# Altium schematic sheet Sch_Master_Screen.SchDoc
size A3; SheetNumber: 1; SheetTotal: 1
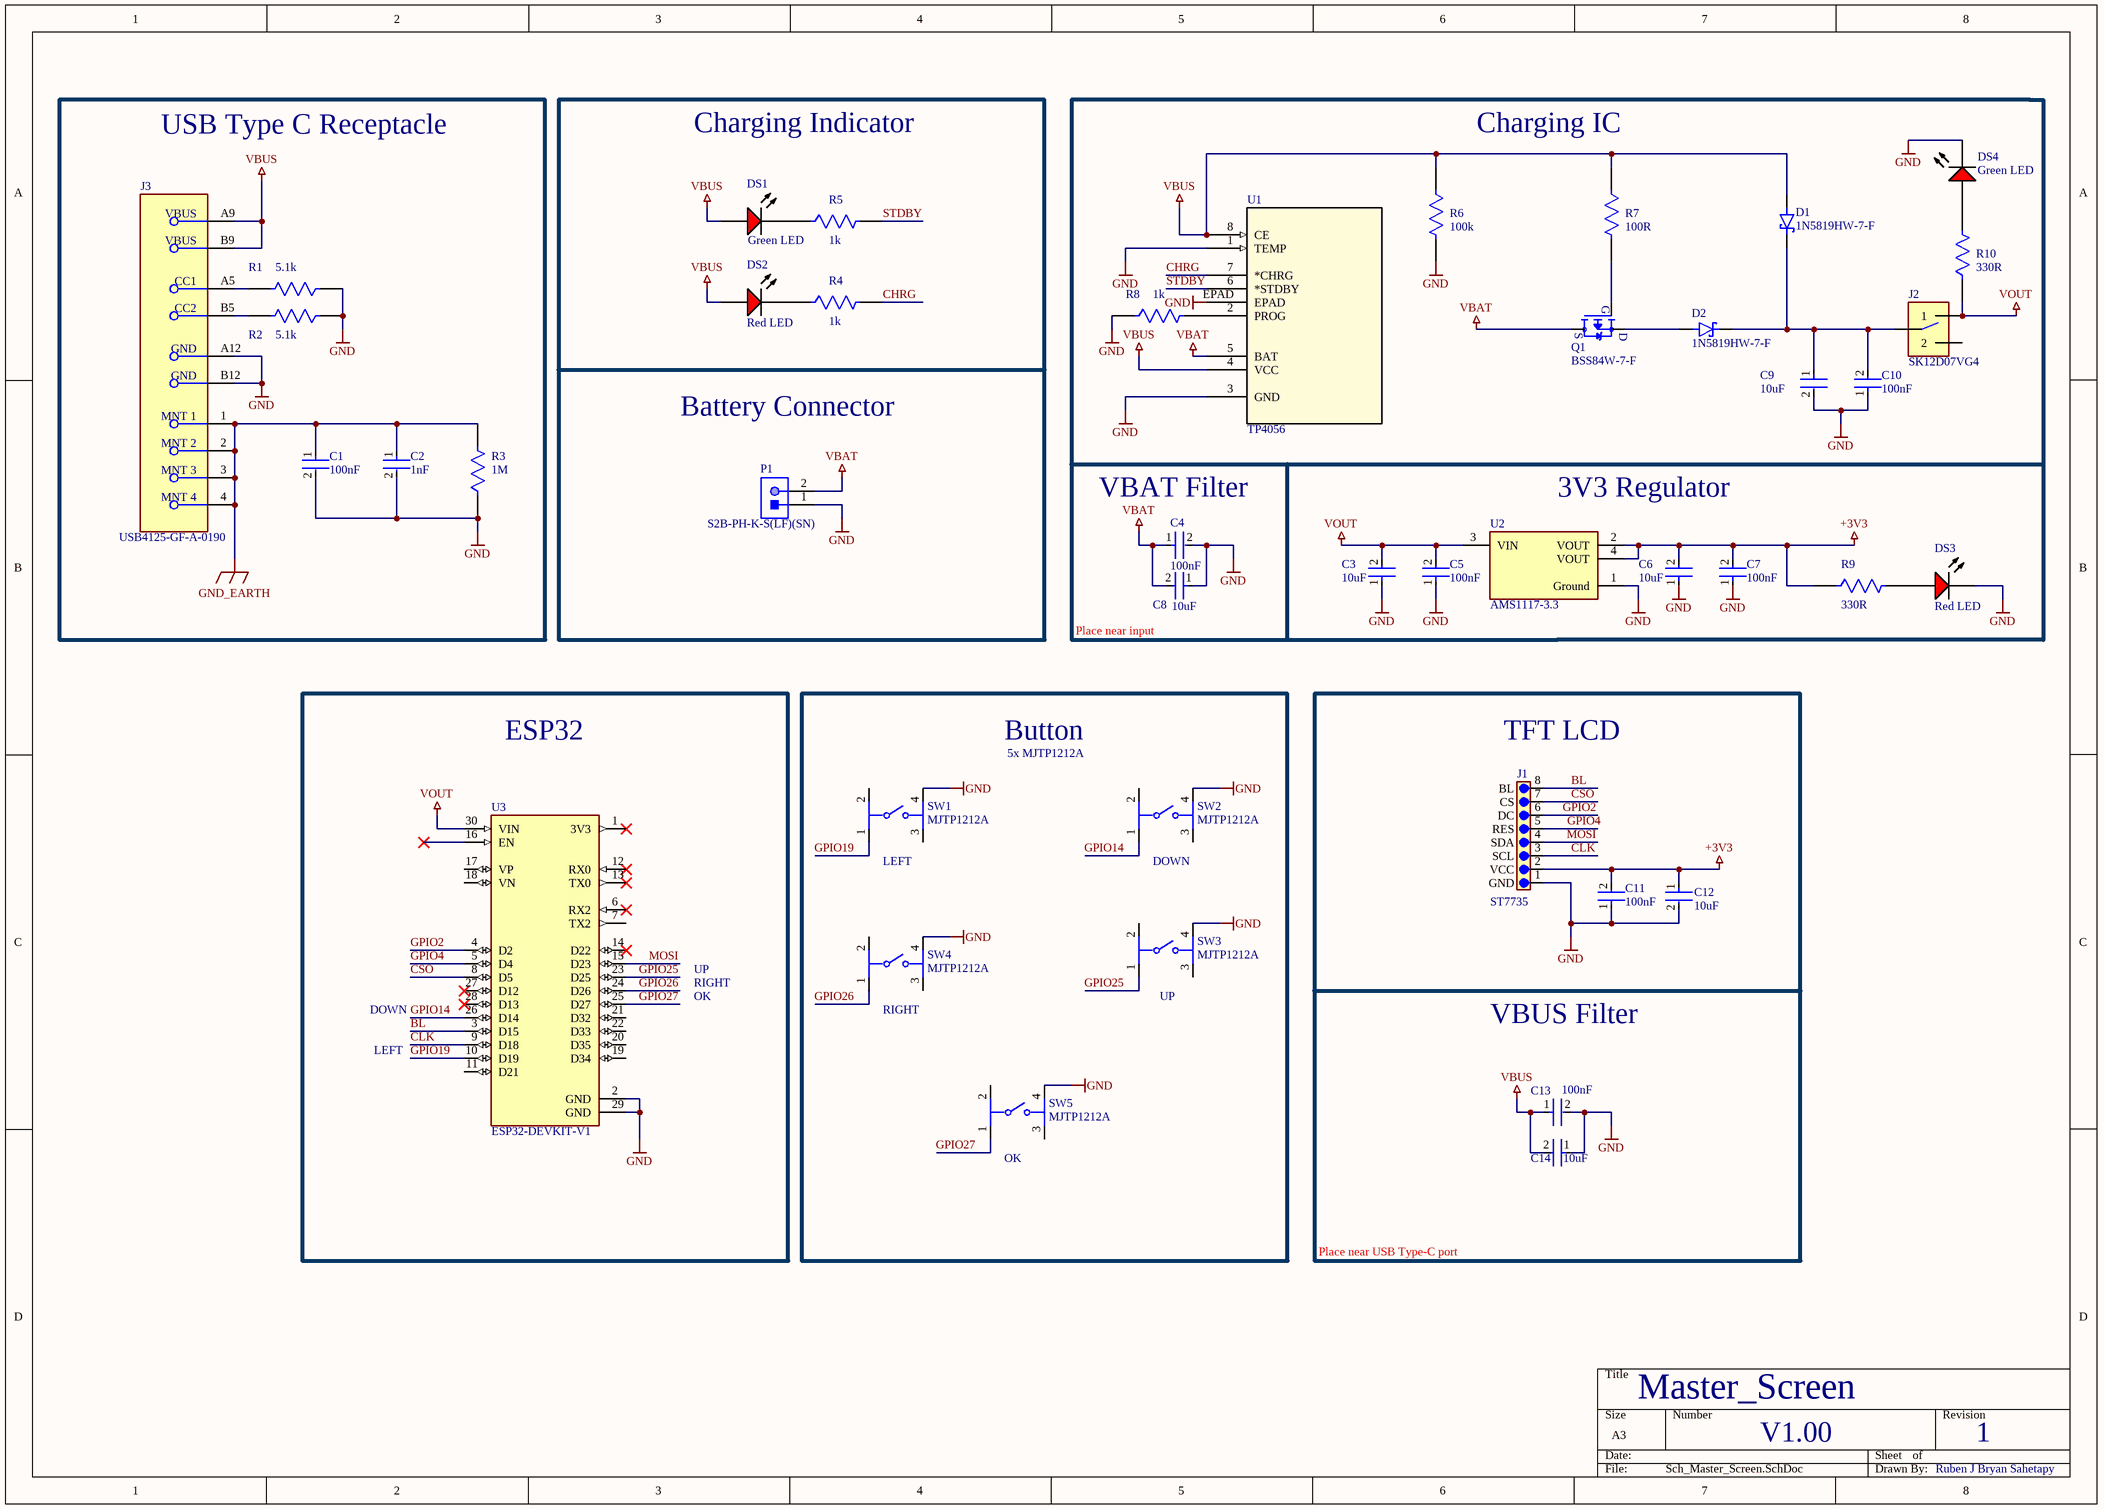
[diagram p0: Sch_Master_Screen.SchDoc]

## Parts
C1  100nF  [FP-CC0805-0_85-MFG]
C2  1nF  [FP-CC0805-0_85-MFG]
C3  10uF  [FP-CC0805-0_85-MFG]
C4  100nF  [FP-CC0805-0_85-MFG]
C5  100nF  [FP-CC0805-0_85-MFG]
C6  10uF  [FP-CC0805-0_85-MFG]
C7  100nF  [FP-CC0805-0_85-MFG]
C8  10uF  [FP-CC0805-0_85-MFG]
C9  10uF  [FP-CC0805-0_85-MFG]
C10  100nF  [FP-CC0805-0_85-MFG]
C11  100nF  [FP-CC0805-0_85-MFG]
C12  10uF  [FP-CC0805-0_85-MFG]
C13  100nF  [FP-CC0805-0_85-MFG]
C14  10uF  [FP-CC0805-0_85-MFG]
D1  1N5819HW-7-F  [SOD3715X145N]
D2  1N5819HW-7-F  [SOD3715X145N]
DS1  Green LED  [LUMX-SML-LX1206IC_V]
DS2  Red LED  [LUMX-SML-LX1206IC_V]
DS3  Red LED  [LUMX-SML-LX1206IC_V]
DS4  Green LED  [LUMX-SML-LX1206IC_V]
J1  ST7735  [ST7735]
J2  SK12D07VG4  [SK12D07VG4]
J3  USB4125-GF-A-0190  [FP-USB4125-GF-A-0190-MFG]
P1  S2B-PH-K-S(LF)(SN)  [JST-S2B-PH-K-S_V]
Q1  BSS84W-7-F  [SOT65P222X110-3N]
R1  5.1k  [FP-RC1206-MFG]
R2  5.1k  [FP-RC1206-MFG]
R3  1M  [FP-RC1206-MFG]
R4  1k  [FP-RC1206-MFG]
R5  1k  [FP-RC1206-MFG]
R6  100k  [FP-RC1206-MFG]
R7  100R  [FP-RC1206-MFG]
R8  1k  [FP-RC1206-MFG]
R9  330R  [FP-RC1206-MFG]
R10  330R  [FP-RC1206-MFG]
SW1  MJTP1212A  [FP-MJTP1212A-MFG]
SW2  MJTP1212A  [FP-MJTP1212A-MFG]
SW3  MJTP1212A  [FP-MJTP1212A-MFG]
SW4  MJTP1212A  [FP-MJTP1212A-MFG]
SW5  MJTP1212A  [FP-MJTP1212A-MFG]
U1  TP4056  [SOP8-PP_TPW]
U2  AMS1117-3.3  [FP-AMS1117-IPC_C]
U3  ESP32-DEVKIT-V1  [MODULE_ESP32_DEVKIT_V1]

## Blocks framed on the sheet
USB Type C Receptacle: C1 C2 J3 R1-R3
ESP32: U3
Button: SW1-SW5

## Nets
+3V3: C6.2 C7.2 C11.2 C12.1 J1.2(VCC) R9.1 U2.2(VOUT) U2.4(VOUT)
GND: C1.2 C2.2 C3.1 C4.2 C5.1 C6.1 C7.1 C8.1 C9.2 C10.1 C11.1 C12.2 C13.2 C14.1 DS3.2(K) DS4.2(K) J1.1(GND) J3.A12(GND) J3.B12(GND) P1.1 R1.1 R2.1 R3.1 R6.2 R8.1 SW1.4 SW2.4 SW3.4 SW4.4 SW5.4 U1.1(TEMP) U1.3(GND) U1.EPAD U2.1(Ground) U3.2(GND) U3.29(GND)
GND_EARTH: C1.1 C2.1 J3.1(MNT_1) J3.2(MNT_2) J3.3(MNT_3) J3.4(MNT_4) R3.2
VBAT: C4.1 C8.2 P1.2 Q1.3(D) U1.5(BAT)
VBUS: C13.1 C14.2 D1.A DS1.1(A) DS2.1(A) J3.A9(VBUS) J3.B9(VBUS) R6.1 R7.1 U1.4(VCC) U1.8(CE)
VOUT: C3.2 C5.2 J2.1 R10.1 U2.3(VIN) U3.30(VIN)
BL: J1.8(BL) U3.3(D15)
CHRG: R4.2 U1.7(*CHRG)
CLK: J1.3(SCL) U3.9(D18)
CSO: J1.7(CS) U3.8(D5)
GPIO2: J1.6(DC) U3.4(D2)
GPIO4: J1.5(RES) U3.5(D4)
GPIO14: SW2.1 U3.26(D14)
GPIO19: SW1.1 U3.10(D19)
GPIO25: SW3.1 U3.23(D25)
GPIO26: SW4.1 U3.24(D26)
GPIO27: SW5.1 U3.25(D27)
MOSI: J1.4(SDA) U3.15(D23)
STDBY: R5.2 U1.6(*STDBY)
NetC9_1: C9.1 C10.2 D1.C(K) D2.C(K) J2.COM
NetD2_A: D2.A Q1.2(S)
NetDS1_2: DS1.2(K) R5.1
NetDS2_2: DS2.2(K) R4.1
NetDS3_1: DS3.1(A) R9.2
NetDS4_1: DS4.1(A) R10.2
NetJ3_A5: J3.A5(CC1) R1.2
NetJ3_B5: J3.B5(CC2) R2.2
NetQ1_1: Q1.1(G) R7.2
NetR8_2: R8.2 U1.2(PROG)

Not connected (* = marked no-connect by the designer): J2 2; SW1 2 3; SW2 2 3; SW3 2 3; SW4 2 3; SW5 2 3; U3 1(3V3)* 6(RX2)* 7(TX2) 11(D21) 12(RX0)* 13(TX0)* 14(D22)* 16(EN)* 17(VP) 18(VN) 19(D34) 20(D35) 21(D32) 22(D33) 27(D12)* 28(D13)*

## Notes on the sheet
- Charging Indicator
- Charging IC
- Battery Connector
- (near C4) VBAT Filter
- 3V3 Regulator
- (near C8) Place near input
- 5x MJTP1212A
- (near J1) TFT LCD
- (near SW1) LEFT
- (near SW2) DOWN
- RIGHT
- UP
- DOWN
- LEFT
- OK
- (near SW4) RIGHT
- (near SW3) UP
- VBUS Filter
- (near SW5) OK
- Place near USB Type-C port
- Master_Screen
- V1.00
- 1
- Ruben J Bryan Sahetapy

## Library data of the parts
C1 C4 C5 C7 C10 C11 C13 = CMP-1036-04402-6: CAP CER 0.1UF 16V X7R 0805; Manufacturer Part Number: CC0805KRX7R7BB104; Manufacturer: Yageo; Material: Ceramic; Tolerance: 0.1; Temperature: -30°C to +85°C; Lead Free: Yes; Footprint Url: http://www.yageo.com/exep/pages/download/literatures/UPY-C_GEN_24.pdf; Voltage Rating: 16 V; Package: CC0805-0.85; RoHS: TRUE; Digikey Description: CAP CER 0.1UF 16V X7R 0805; Category: Cap; Octopart: https://octopart.com/cc0805krx7r7bb104-yageo-39467769; Capacitance: 100 nF; Device Class L3: Ceramic Capacitors; ComponentLink2URL: http://www.yageo.com/documents/recent/UPY-GPHC_Y5V_6.3V-to-50V_8.pdf; Value: 100 nF; Temperature Range Low: -30°C; Mouser Description: Multilayer Ceramic Capacitors MLCC - SMD/SMT 100nF 16V X7R 10%; Automotive: No; Device Class L2: Capacitors; Height: 0.95mm; ComponentLink2Description: Datasheet; Temperature Characteristic: X7R; Ipc Land Pattern Name: CAPC200125X85; Device Class L1: Passive Components; Temperature Range High: +85°C
C2 C3 C6 C8 C9 C12 C14 = CMP-1036-04402-6: CAP CER 0.1UF 16V X7R 0805; Manufacturer Part Number: CC0805KRX7R7BB104; Manufacturer: Yageo; Material: Ceramic; Tolerance: 0.1; Capacitance: 100 nF; Value: 100 nF; Temperature: -30°C to +85°C; Lead Free: Yes; Footprint Url: http://www.yageo.com/exep/pages/download/literatures/UPY-C_GEN_24.pdf; Voltage Rating: 16 V; Package: CC0805-0.85; RoHS: TRUE; Digikey Description: CAP CER 0.1UF 16V X7R 0805; Category: Cap; Octopart: https://octopart.com/cc0805krx7r7bb104-yageo-39467769; Device Class L3: Ceramic Capacitors; ComponentLink2URL: http://www.yageo.com/documents/recent/UPY-GPHC_Y5V_6.3V-to-50V_8.pdf; Temperature Range Low: -30°C; Mouser Description: Multilayer Ceramic Capacitors MLCC - SMD/SMT 100nF 16V X7R 10%; Automotive: No; Device Class L2: Capacitors; Height: 0.95mm; ComponentLink2Description: Datasheet; Temperature Characteristic: X7R; Ipc Land Pattern Name: CAPC200125X85; Device Class L1: Passive Components; Temperature Range High: +85°C
D1 D2 = 1N5819HW-7-F: Schottky Diodes & Rectifiers SOD-123; Value: Vf = 450 mV; MF: Diodes Inc.; SnapEDA_Link: https://www.snapeda.com/parts/1N5819HW-7-F/Diodes+Inc./view-part/?ref=snap; Purchase-URL: https://pricing.snapeda.com/search/part/1N5819HW-7-F/?ref=eda; Availability: In Stock; Price: None; Package: SOD-123 Fairchild Semiconductor; Check_prices: https://www.snapeda.com/parts/1N5819HW-7-F/Diodes+Inc./view-part/?ref=eda; MP: 1N5819HW-7-F; Part Number: 1N5819HW-7-F; PartID: 1N5819HW-7-F; TempMin: -65; TempMax: 125; Link: https://4donline.ihs.com/images/VipMasterIC/IC/DIOD/DIOD-S-A0011437026/DIOD-S-A0011683586-1.pdf?hkey=CECEF36DEECDED6468708AAF2E19C0C6
DS1-DS4 = CMP-2000-07123-1: LED Red, 65 mW, -40 to 85 degC, 2-Pin SMD, RoHS, Tape and Reel; Manufacturer: Lumex; Part No: SML-LX1206IC-TR; LED Material: GaAsP; Peak Wavelength: 635nm; Number of LEDs: 1; Viewing Angle: 160; Reverse Voltage: 5(Min)V; Lens Appearance: ColorlessNonDiffused; Intensity: 6mcd; Type: Uni-Color; Pin_Count: 2; Lens Dimensions: 2x1.6x0.5mm; Mounting: SurfaceMount; ECCN: EAR99; RoHS: Unknown; Package Description: 2-Pin Surface Mount Device, Body 3.2 x 1.5 mm; Mounting Technology: SurfaceMount; Dominant Wavelength: N/A; Supplier_Package: SMD; Supplier Standard Pack: 3,000; Color: Red; Dimension: 3.2x1.6x1.1mm; HTS: 8541402000; Family: SML-LX1206IC; Supplier: Lumex; Datasheet URL: http://www.lumex.com/content/files/ProductAttachment/SML-LX1206IC-TR.pdf; Package Reference: SML-LX1206IC; Manufacturer URL: http://www.lumexinstruments.com/; Operating Temperature: -25to85C; Packaging: TapeandReel; Datasheet Version: Rev. J, 08/2012
J1 = TFT-ST7735: 1.8 inches 128x160 RGB TFT LCD - ST7735 DRIVER; Value: 1.8 Inch 128x160; Part Number: TFT-ST7735; PartID: TFT-ST7735; TempMin: -30; TempMax: 80; Link: https://grabcad.com/library/1-8-inches-128x160-rgb-tft-lcd-st7735-driver-1
J2 = SK12D07VG4: Slide Switches - Side Knob; Value: 0.3A @ 30 VDC; MF: C&K; SnapEDA_Link: https://www.snapeda.com/parts/SK12D07VG4/C%2526K/view-part/?ref=snap; Package: None; MP: SK12D07VG4; Check_prices: https://www.snapeda.com/parts/SK12D07VG4/C%2526K/view-part/?ref=eda; Part Number: SK12D07VG4; PartID: SK12D07VG4; TempMin: -20; TempMax: 70; Link: https://www.snapeda.com/parts/SK12D07VG4/C&K/datasheet/
J3 = CMP-245163-000004-1: CONN RCPT TYPE C 6P SMD RA
P1 = CMP-1755-00004-1: Male Header, Pitch 2 mm, 1 x 2 Position, Height 4.8 mm, Tail Length 3.4 mm, -25 to 85 degC, RoHS, Bulk; Case\Package: Radial; Tolerance: 20%; Capacitance: 10 uF; Voltage Rating (DC): 50 V; Packaging: Bulk; ComponentLink1URL: http://www.jst-mfg.com/product/pdf/eng/ePH.pdf; Radiation Hardening: No; Height: 11 mm; Package Quantity: 200; PackageDescription: Male Header, Pitch 2 mm, 1 x 2 Position, Height 4.8 mm, Tail Length 3.4 mm; PackageReference: S2B-PH-K-S; Diameter: 5 mm; Pins: 2; Mount: Through Hole; Max Operating Temperature: 85 degC; Min Operating Temperature: -40 degC; ComponentLink1Description: Datasheet; DatasheetVersion: Dec-12; Length: 11 mm; Lead Pitch: 2 mm; REACH SVHC: No SVHC; Voltage Rating: 50 V; RoHSCompliant: true
Q1 = BSS84W-7-F: MOSFET P-Channel 50V 130MA SOT323; MF: Diodes Inc.; SnapEDA_Link: https://www.snapeda.com/parts/BSS84W-7-F/Diodes+Inc./view-part/?ref=snap; Availability: In Stock; Check_prices: https://www.snapeda.com/parts/BSS84W-7-F/Diodes+Inc./view-part/?ref=eda; MP: BSS84W-7-F; Price: None; Purchase-URL: https://pricing.snapeda.com/search/part/BSS84W-7-F/?ref=eda; Package: SOT-323 Diodes Inc.; Value: 0 V 130mA; Part Number: BSS84W-7-F; PartID: BSS84W-7-F; TempMin: -55; TempMax: 150; Link: https://www.diodes.com/assets/Datasheets/BSS84W.pdf
R1-R10 = CMP-2100-03681-2: RES SMD 0 OHM JUMPER 1/4W 1206; Manufacturer Part Number: RC1206JR-070RL; Manufacturer: YAGEO; Voltage Rating: 200V; Temperature Coefficient: 300ppm/°C; Power Rating: 0.25W; Value: 0Ω; Tolerance: 5%; Temperature Range Low: -55°C; Category: Res; Automotive: No; Ipc Land Pattern Name: RESC310160X55; Device Class L1: Passive Components; Temperature: -55°C to +155°C; ComponentLink2URL: https://www.yageo.com/upload/media/product/productsearch/datasheet/rchip/PYu-RC_Group_51_RoHS_L_10.pdf; Lead Free: Yes; Height: 0.65mm; Footprint Url: https://www.yageo.com/upload/website/yageo_PYu-R_Mount_10_19050818_343.pdf; Package: RC1206; Digikey Description: RES SMD 0 OHM JUMPER 1/4W 1206; Temperature Range High: +155°C; Device Class L3: Chip SMD Resistors; Device Class L2: Resistors; Octopart: https://octopart.com/rc1206jr-070rl-yageo-40025601; Resistance: 0Ω; Series: RC; ComponentLink2Description: Datasheet; Composition: Thick Film; RoHS: TRUE; Mouser Description: Resistor: thick film; SMD; 1206; 0O; 0.25W; ±5%; -55÷155°C
SW1-SW5 = MJTP1212A: Switch Tactile Button 12x12mm; Contact Resistance: 100mR; Operating Force: 160gf; Max Voltage Rating (DC): 12V; Mechanical Life: 100000Cycles; Actuator Length: 3.5mm; Throw Configuration: SPST; Illumination Type: Non-Illuminated; Actuator Material: Polyoxymethylene; Actuator Type: Standard; Switch Travel: 0.3mm; Current Rating: 50mA; Switch Function: Off-Mom; Value: 0.05A @ 12VDC; Mount: Through Hole; Contact Plating: Silver; Package Quantity: 100; Max Operating Temperature: 70°C; Packaging: Bulk; Voltage Rating (DC): 12V; Termination: PC Pin; Contact Material: Bronze; Orientation: Straight; Min Operating Temperature: -20°C; REACH SVHC: No SVHC; Electrical Life: 100000Cycles; Part Number: MJTP1212A; PartID: MJTP1212A; TempMin: -25; TempMax: 70; Link: https://www.digikey.de/de/products/detail/omron-electronics-inc-emc-div/B3F-4055/31799?gclsrc=aw.ds&gad_source=1&gad_campaignid=19971370784&gbraid=0AAAAADrbLlgb8g5iB56Pq7GBfmlW8M2um&gclid=CjwKCAiA2svIBhB-EiwARWDPjsxJrtH3aqZi4wzUZvXY0ugmwA-CuPqPru_7AumdmvXcQLZq2TM71hoCQyEQAvD_BwE
U1 = TP4056: charger for single cell lithium-ion batteries; Manufacturer_Name: TPOWER; Value: 1A single cell; Copyright: Copyright (C) 2025 Ultra Librarian. All rights reserved.; Manufacturer_Part_Number: TP4056; RefDes: RefDes; Type: Type; Part Number: TP4056; PartID: TP4056; TempMin: -40; TempMax: 85; Link: https://dlnmh9ip6v2uc.cloudfront.net/datasheets/Prototyping/TP4056.pdf
U2 = CMP-209535-000001-1: LDO Voltage Regulators 1A, 3.3V; Manufacturer: Advanced Monolithic Systems; Dropout Voltage: 1.1V; Output Type: Fixed; Nominal Supply Current: 5mA; Max Power Dissipation: 1.2W; Max Supply Voltage: 15V; Number Of Outputs: 1; Standoff Height: 0.64mm; Max Junction Temp: +125°C; Height: 1.8mm; Package: AMS1117; Device Class L2: Power Management ICs; ComponentLink2Description: Datasheet; ComponentLink2URL: http://www.advanced-monolithic.com/pdf/ds1117.pdf; Category: IC; RoHS: TRUE; Automotive: No; Device Class L1: Integrated Circuits (ICs); Output Current: 1A; Device Class L3: Voltage Regulators - Linear; Temperature: -40°C to +125°C; Output Voltage: 3.3V; Manufacturer Part Number: AMS1117-3.3; Temperature Range Low: -40°C; Octopart: https://octopart.com/ams1117-3.3-advanced+monolithic+systems-25899300; Lead Free: Yes; Ipc Land Pattern Name: SOT229P700X180-4; Temperature Range High: +125°C
U3 = ESP32-DEVKIT-V1: ESP32-DEVKIT-V1 30 Pins; Value: Dual Core, Wi-Fi, BLE; MF: Do it; SnapEDA_Link: https://www.snapeda.com/parts/ESP32-DEVKIT-V1/Do+it/view-part/?ref=snap; Package: None; MP: ESP32-DEVKIT-V1; Check_prices: https://www.snapeda.com/parts/ESP32-DEVKIT-V1/Do+it/view-part/?ref=eda; Part Number: ESP32-DEVKIT-V1; PartID: ESP32-DEVKIT-V1; TempMin: -40; TempMax: 85; Link: https://www.snapeda.com/parts/ESP32-DEVKIT-V1/Do+it/view-part/?ref=eda